# Altium schematic sheet sprinkler_photon_0v2.SchDoc: INTERNET SPRINKLER
size Letter; Author: Arthur Sobel; CompanyName: Advanced RISC Technology; DrawnBy: Arthur Sobel; Organization: Advanced RISC Technology; Address1: Box 195; Address2: Los Altos Ca 94023; DocumentNumber: ARTPHO002; Revision: 0.2; SheetNumber: 1; SheetTotal: 1; DocumentName: IMP SPRINKLER BASIC; ProjectName: IMP SPRINKLER BASIC
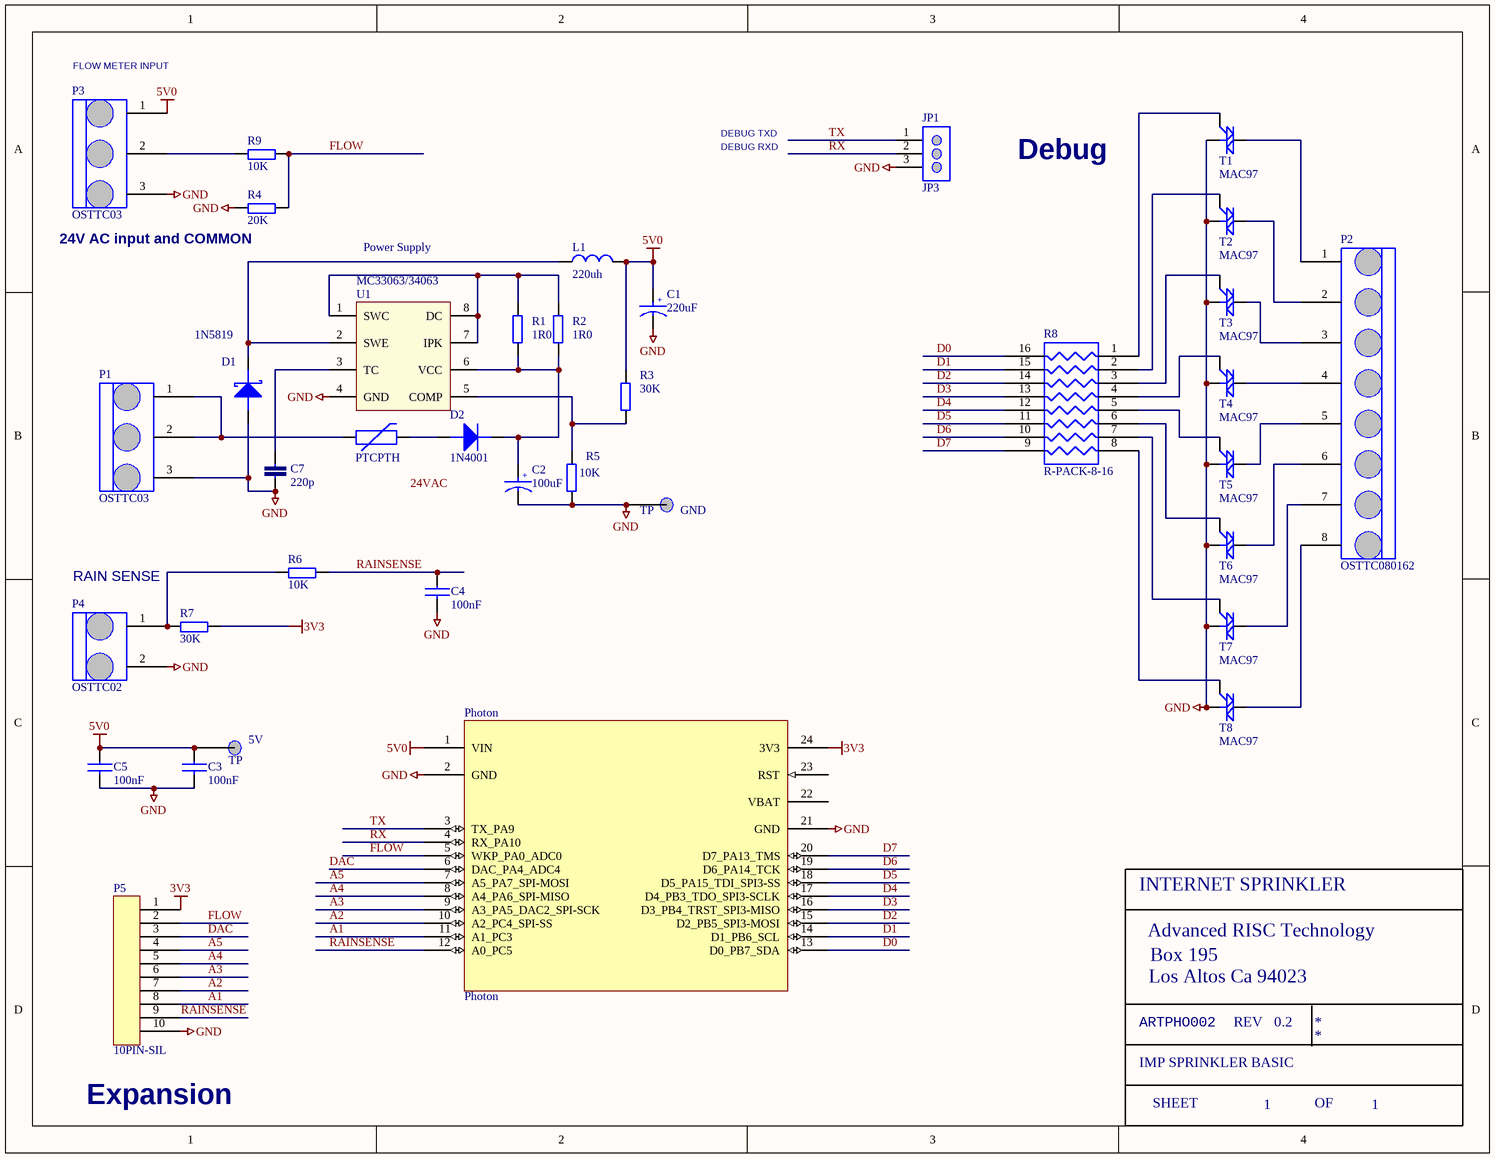
[diagram p0: sprinkler_photon_0v2.SchDoc]

## Parts
5V  TP  [SIP-1]
C1  220uF  [RB-2MM-5MM]
C2  100uF  [RB-3.5MM-8MM]
C3  100nF  [RAD-0.1]
C4  100nF  [RAD-0.1]
C5  100nF  [RAD-0.1]
C7  220p  [RADCAP-0.1]
D1  1N5819  [AXIAL-0.4 - DIODE]
D2  1N4001  [AXIAL-0.4 - DIODE]
GND  TP  [SIP-1]
JP1  JP3  [SIP-3]
L1  220uh  [RB-5MM - 9MMDIA]
P1  OSTTC03  [OSTTC03]
P2  OSTTC080162  [OSTTC08]
P3  OSTTC03  [OSTTC03]
P4  OSTTC02  [OSTTC02]
P5  10PIN-SIL  [SIP-10]
Photon  Photon  [PHOTON]
PTC  PTCPTH  [PTC]
R1  1R0  [AXIAL-0.5]
R2  1R0  [AXIAL-0.5]
R3  30K  [AXIAL-0.4]
R4  20K  [AXIAL-0.4]
R5  10K  [AXIAL-0.4]
R6  10K  [AXIAL-0.4]
R7  30K  [AXIAL-0.4]
R8  R-PACK-8-16  [DIP-16]
R9  10K  [AXIAL-0.4]
T1  MAC97  [TO-92]
T2  MAC97  [TO-92]
T3  MAC97  [TO-92]
T4  MAC97  [TO-92]
T5  MAC97  [TO-92]
T6  MAC97  [TO-92]
T7  MAC97  [TO-92]
T8  MAC97  [TO-92]
U1  MC33063/34063  [DIP8]

## Nets
3V3: P5.1 Photon.24(3V3) R7.2
5V0: 5V.1 C1.1 C3.1 C5.1 L1.2 P3.1 Photon.1(VIN) R3.1
GND: C1.2 C2.2 C3.2 C4.2 C5.2 C7.2 D1.1(A) GND.1 JP1.3 P1.3 P3.3 P4.2 P5.10 Photon.2(GND) Photon.21(GND) R4.1 R5.2 T1.1(M1) T2.1(M1) T3.1(M1) T4.1(M1) T5.1(M1) T6.1(M1) T7.1(M1) T8.1(M1) U1.4(GND)
A1: P5.8 Photon.11(A1_PC3)
A2: P5.7 Photon.10(A2_PC4_SPI-SS)
A3: P5.6 Photon.9(A3_PA5_DAC2_SPI-SCK)
A4: P5.5 Photon.8(A4_PA6_SPI-MISO)
A5: P5.4 Photon.7(A5_PA7_SPI-MOSI)
D0: Photon.13(D0_PB7_SDA) R8.16(R1)
D1: Photon.14(D1_PB6_SCL) R8.15(R2)
D2: Photon.15(D2_PB5_SPI3-MOSI) R8.14(R3)
D3: Photon.16(D3_PB4_TRST_SPI3-MISO) R8.13(R4)
D4: Photon.17(D4_PB3_TDO_SPI3-SCLK) R8.12(R5)
D5: Photon.18(D5_PA15_TDI_SPI3-SS) R8.11(R6)
D6: Photon.19(D6_PA14_TCK) R8.10(R7)
D7: Photon.20(D7_PA13_TMS) R8.9(R8)
DAC: P5.3 Photon.6(DAC_PA4_ADC4)
FLOW: P5.2 Photon.5(WKP_PA0_ADC0) R4.2 R9.2
RAINSENSE: C4.1 P5.9 Photon.12(A0_PC5) R6.2
RX: JP1.2 Photon.4(RX_PA10)
TX: JP1.1 Photon.3(TX_PA9)
NetC2_1: C2.1 D2.2(K) R1.2 R2.2 U1.6(VCC)
NetC7_1: C7.1 U1.3(TC)
NetD1_2: D1.2(K) L1.1 U1.2(SWE)
NetD2_1: D2.1(A) PTC.2
NetP1_1: P1.1 P1.2 PTC.1
NetP2_1: P2.1 T1.3(M2)
NetP2_2: P2.2 T2.3(M2)
NetP2_3: P2.3 T3.3(M2)
NetP2_4: P2.4 T4.3(M2)
NetP2_5: P2.5 T5.3(M2)
NetP2_6: P2.6 T6.3(M2)
NetP2_7: P2.7 T7.3(M2)
NetP2_8: P2.8 T8.3(M2)
NetP3_2: P3.2 R9.1
NetP4_1: P4.1 R6.1 R7.1
NetR1_1: R1.1 R2.1 U1.1(SWC) U1.7(IPK) U1.8(DC)
NetR3_2: R3.2 R5.1 U1.5(COMP)
NetR8_1: R8.1(R1) T1.2(G)
NetR8_2: R8.2(R2) T2.2(G)
NetR8_3: R8.3(R3) T3.2(G)
NetR8_4: R8.4(R4) T4.2(G)
NetR8_5: R8.5(R5) T5.2(G)
NetR8_6: R8.6(R6) T6.2(G)
NetR8_7: R8.7(R7) T7.2(G)
NetR8_8: R8.8(R8) T8.2(G)

Not connected (* = marked no-connect by the designer): Photon 22(VBAT) 23(RST)

## Notes on the sheet
- (near P3) FLOW METER INPUT
- DEBUG RXD
- DEBUG TXD
- Debug
- 24V AC input and COMMON
- Power Supply
- RAIN SENSE
- (near P5) Expansion
- Labels drawn without touching a wire or pin: 24VAC
- REV
- SHEET
- OF
- (in symbol CAP POL) +

## Library data of the parts
5V GND = TPS: Test Point; COMPONENTLINK1DESCRIPTION: DATASHEET; DISTRIBUTOR: DIGIKEY
C1 = CAP POL: CAP ALUM 220UF 6.3V 20% RADIAL; MANUFACTURER: Nichicon; MANUFACTURER PART#: UVR0J221MDD; PROTOTYPE PRICE: 0.156; VOLUME PRICE: 0.054; ComponentLink1URL: http://www.nichicon.co.jp/english/products/pdfs/e-vr.pdf; COMPONENTLINK1DESCRIPTION: DATASHEET; DISTRIBUTOR: Digikey; DISTRIBUTOR PART#: 493-1004-ND
C2 = CAP POL: CAP ALUM 100UF 50V 20% RADIAL; MANUFACTURER: Nichicon; MANUFACTURER PART#: UVR1H101MPD; PROTOTYPE PRICE: 0.21; VOLUME PRICE: 0.073; ComponentLink1URL: http://www.nichicon.co.jp/english/products/pdfs/e-vr.pdf; COMPONENTLINK1DESCRIPTION: DATASHEET; DISTRIBUTOR: Digikey; DISTRIBUTOR PART#: 493-1107-ND
C3-C5 = CAP NP: CAP CER 0.1UF 25V 10% RADIAL; MANUFACTURER: TDK; MANUFACTURER PART#: FK18X7R1E104K; PROTOTYPE PRICE: 0.20; VOLUME PRICE: 0.07; COMPONENTLINK1DESCRIPTION: DATASHEET; DISTRIBUTOR: Digikey; DISTRIBUTOR PART#: 445-8421-ND
C7 = C-EU025-024X044: CAP CER 220PF 100V 5% RADIAL; MANUFACTURER: AVX; MANUFACTURER PART#: SR151A221JAR; PROTOTYPE PRICE: 0.19; VOLUME PRICE: 0.068; COMPONENTLINK1URL: http://www.avx.com/docs/catalogs/skycap.pdf; DISTRIBUTOR: Digikey; DISTRIBUTOR PART#: 478-4847-ND
D1 = DIODE SCHOTTKY: DIODE SCHOTTKY 40V 1A DO-41; MANUFACTURER: Diodes; MANUFACTURER PART#: 1N5819-T; PROTOTYPE PRICE: 0.31; VOLUME PRICE: 0.11; DISTRIBUTOR: DIGIKEY; DISTRIBUTOR PART#: 1N5819DICT-ND; COMPONENTLINK1DESCRIPTION: DATASHEET
D2 = DIODE: RECTIFIER 50V 1A DO-41; MANUFACTURER: Diodes; MANUFACTURER PART#: 1N4001-T; PROTOTYPE PRICE: 0.13; VOLUME PRICE: 0.028; DISTRIBUTOR: DIGIKEY; DISTRIBUTOR PART#: 1N4001DICT-ND; COMPONENTLINK1DESCRIPTION: DATASHEET
JP1 = JP3: 3 PIN JUMPER; Manufacturer: Harwin; MANUFACTURER PART#: M20-9990346; VOLUME PRICE: .08; PROTOTYPE PRICE: .14; DISTRIBUTOR PART#: 952-2264-ND
L1 = INDUCTOR: MANUFACTURER: Abracon; MANUFACTURER PART#: AIUR-02H-221K; PROTOTYPE PRICE: 0.35; VOLUME PRICE: 0.22; COMPONENTLINK1DESCRIPTION: DATASHEET; DISTRIBUTOR: Digikey; DISTRIBUTOR PART#: AIUR-02H-221K-ND
P1 P3 = 3PIN-POW: TERMINAL BLOCK 5MM VERT 3POS PCB; Manufacturer: Onshore; MANUFACTURER PART#: OSTTC030162; PROTOTYPE PRICE: 0.68; VOLUME PRICE: 0.43; ComponentLink1URL: http://www.te.com/commerce/DocumentDelivery/DDEController?Action=srchrtrv&DocNm=796644&DocType=Customer+Drawing&DocLang=English; DISTRIBUTOR: Digikey; DISTRIBUTOR PART#: ED2601-ND
P2 = 8PIN-POW: TERMINAL BLOCK 5MM VERT 8POS PCB; Manufacturer: OnShore; PROTOTYPE PRICE: 1.05; VOLUME PRICE: 0.659; COMPONENTLINK1URL: http://www.on-shore.com/sites/default/files/manuals/osttcxx0162.pdf; DISTRIBUTOR: Digikey; DISTRIBUTOR PART#: ED2606-ND; MANUFACTURER PART#: OSTTC080162
P4 = 2PIN-POW: TERMINAL BLOCK 5MM VERT 2POS PCB; Manufacturer: Onshore; MANUFACTURER PART#: OSTTC020162; PROTOTYPE PRICE: 0.36; VOLUME PRICE: 0.18; DISTRIBUTOR: Digikey; DISTRIBUTOR PART#: ED2600-ND
P5 = 10PIN-SIL: Manufacturer: Harwin; MANUFACTURER PART#: M20-9991046; VOLUME PRICE: .17; PROTOTYPE PRICE: .35; COMPONENTLINK1URL: https://cdn.harwin.com/pdfs/60page146.pdf; DISTRIBUTOR: Digikey; DISTRIBUTOR PART#: 952-1843-ND
Photon = Photon: MANUFACTURER: Particle.io; PROTOTYPE PRICE: 19.95; VOLUME PRICE: 17.95; DISTRIBUTOR: Sparkfun; DISTRIBUTOR PART#: WRL-13764; MANUFACTURER PART#: Photon
PTC = PTCPTH: FUSE PTC RESETTABLE .75A HOLD; MANUFACTURER: Bournes; MANUFACTURER PART#: MF-R075; PROTOTYPE PRICE: 0.25; VOLUME PRICE: 0.15; COMPONENTLINK1URL: http://www.bourns.com/data/global/pdfs/mfr.pdf; DISTRIBUTOR: Digikey; DISTRIBUTOR PART#: MF-R075-ND
R1 = R-EU_0204/2V: MANUFACTURER: Stackpole; MANUFACTURER PART#: CFM12JT1R00; PROTOTYPE PRICE: 0.078; VOLUME PRICE: 0.01; DISTRIBUTOR: Digikey; DISTRIBUTOR PART#: S1HCT-ND
R2 = R-EU_0204/2V: RES 1 OHM 1/2W 5% CF MINI; MANUFACTURER: Stackpole; MANUFACTURER PART#: CFM12JT1R00; PROTOTYPE PRICE: 0.078; VOLUME PRICE: 0.01; DISTRIBUTOR: Digikey; DISTRIBUTOR PART#: S1HCT-ND
R3 R7 = R-EU_0204/7: RES 30.1K OHM MET FILM .40W 1%; MANUFACTURER: Vishay; MANUFACTURER PART#: SFR2500003012FR500; PROTOTYPE PRICE: 0.126; VOLUME PRICE: 0.019; DISTRIBUTOR: Digikey; DISTRIBUTOR PART#: PPC30.1KYCT-ND
R4 = R-EU_0204/7: RES 20K OHM 1/4W 5% CARBON FILM; MANUFACTURER: Stackpole; MANUFACTURER PART#: CF14JT20K0; PROTOTYPE PRICE: 0.05; VOLUME PRICE: 0.008; DISTRIBUTOR: Digikey; DISTRIBUTOR PART#: S10KQCT-ND
R5 = R-EU_0204/7: RES MF 1/4W 10K OHM 1% AXIAL; MANUFACTURER: Stackpole; MANUFACTURER PART#: RNF14FTD10K0; PROTOTYPE PRICE: 0.10; VOLUME PRICE: 0.016; DISTRIBUTOR PART#: RNF14FTD10K0CT-ND
R6 R9 = R-EU_0204/7: RES 10K OHM 1/4W 5% CF MINI; MANUFACTURER: Stackpole; MANUFACTURER PART#: CFM14JT10K0; PROTOTYPE PRICE: 0.05; VOLUME PRICE: 0.008; DISTRIBUTOR PART#: S10KQCT-ND
  R9: DISTRIBUTOR: Digikey
R8 = R-PACK-8-16: RES ARRAY 330 OHM 8 RES 16-DIP; Manufacturer: Bournes; MANUFACTURER PART#: 4116R-1-331LF; PROTOTYPE PRICE: .52; VOLUME PRICE: .26; DISTRIBUTOR: Digikey; DISTRIBUTOR PART#: 4116R-1-331LF-ND
T1-T8 = LX807DE: THYRISTOR TRIAC .6A 600V TO92; MANUFACTURER: ON; MANUFACTURER PART#: MAC97A8G; PROTOTYPE PRICE: 0.308; VOLUME PRICE: 0.108; DISTRIBUTOR: Digikey; DISTRIBUTOR PART#: MAC97A8GOS-ND
U1 = MC33063/MC34063P: MANUFACTURER: TI; MANUFACTURER PART#: MC33063AP; PROTOTYPE PRICE: 0.45; VOLUME PRICE: 0.26; DISTRIBUTOR: Digikey; DISTRIBUTOR PART#: 296-17764-5-ND